# EAGLE design ABC_proto (EAGLE 6.3)
ABC - Advanced Battery Charger Intel Galileo shield with buttons, ADC divider/amplifier Cezary Rutkowski diploma work Wojskowa Akademia Techniczna
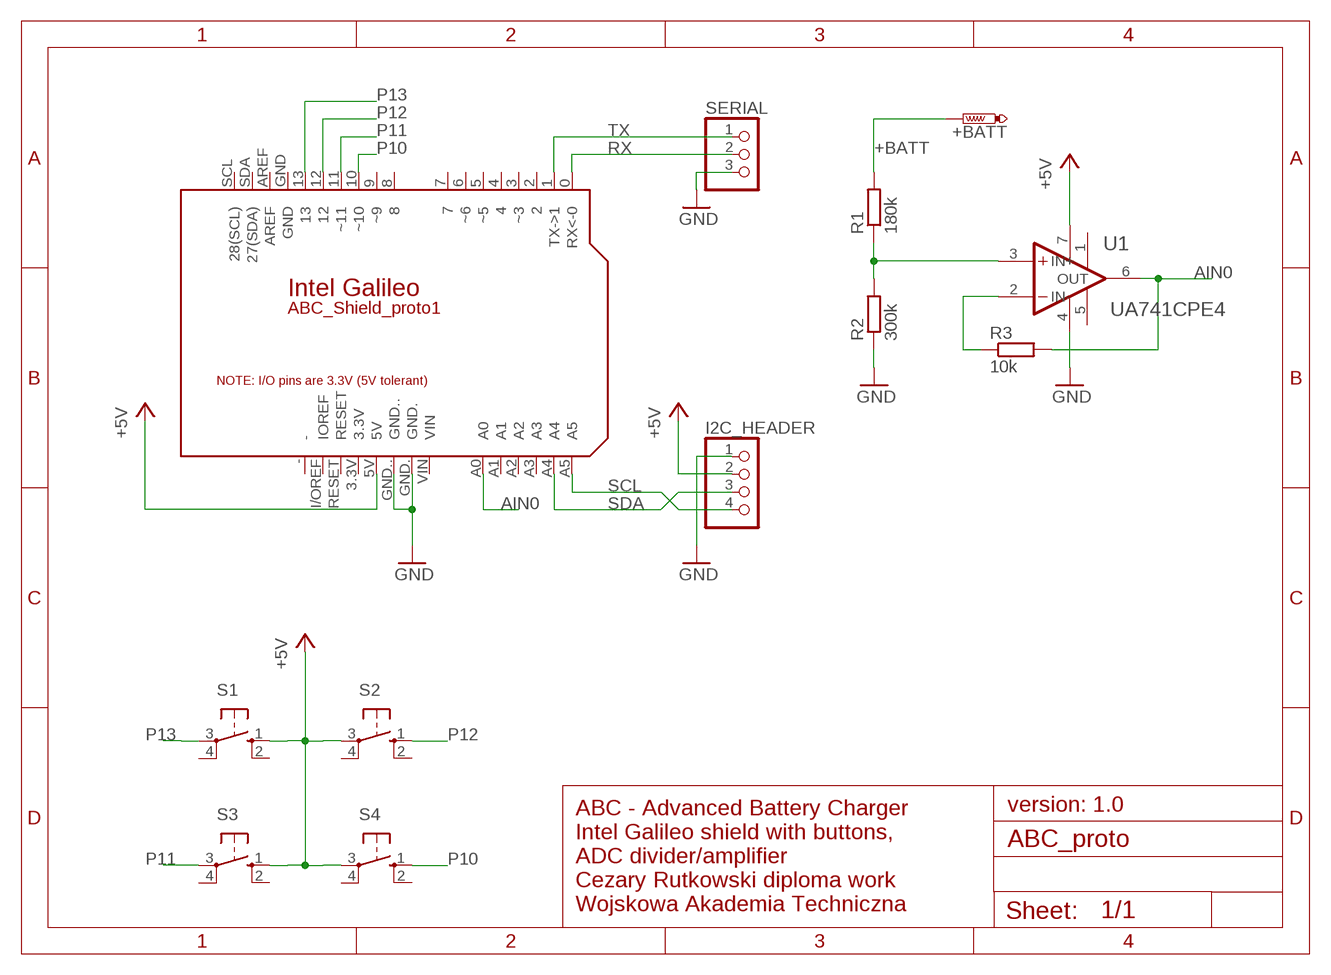
[diagram p0: schematic, sheet 1]

## Parts
+BATT  PTR1PAD1-20Y  [P1-20Y]
I2C_HEADER  PINHD-1X4  [1X04]
PCB1  ARDUINO_101  [ARDUINO_GALILEO]
R1  180k  R-EU_0204/5  [0204/5]
R2  300k  R-EU_0204/5  [0204/5]
R3  10k  R-EU_0204/5  [0204/5]
S1  10-XX  [B3F-10XX]
S2  10-XX  [B3F-10XX]
S3  10-XX  [B3F-10XX]
S4  10-XX  [B3F-10XX]
SERIAL  PINHD-1X3  [1X03]
U1  UA741CPE4  [DIP254P762X508-8]

## Nets
+5V: I2C_HEADER.2 PCB1.5V S1.1(S) S2.3(P) S3.1(S) S4.3(P) U1.7(VCC+)
+BATT: +BATT.TP R1.2
AIN0: PCB1.A0 R3.2 U1.6(OUT)
DIV: R1.1 R2.2 U1.3(IN+)
GND: I2C_HEADER.1 PCB1.GND. PCB1.GND.. R2.1 SERIAL.3 U1.4(VCC-)
N$1: R3.1 U1.2(IN-)
P10: PCB1.10(~10) S4.1(S)
P11: PCB1.11(~11) S3.3(P)
P12: PCB1.12 S2.1(S)
P13: PCB1.13 S1.3(P)
RX: PCB1.0(RX<-0) SERIAL.2
SCL: I2C_HEADER.4 PCB1.A5
SDA: I2C_HEADER.3 PCB1.A4
TX: PCB1.1(TX->1) SERIAL.1
Unconnected: PCB1.2 PCB1.3(~3) PCB1.3.3V PCB1.4 PCB1.5(~5) PCB1.6(~6) PCB1.7 PCB1.8 PCB1.9(~9) PCB1.- PCB1.A1 PCB1.A2 PCB1.A3 PCB1.AREF PCB1.GND PCB1.I/OREF(IOREF) PCB1.RESET PCB1.SCL(28(SCL)) PCB1.SDA(27(SDA)) PCB1.VIN S1.2(S1) S1.4(P1) S2.2(S1) S2.4(P1) S3.2(S1) S3.4(P1) S4.2(S1) S4.4(P1) U1.1(OFS_N1) U1.5(OFS_N2)

## Notes on the sheet
- ABC_Shield_proto1
- version: 1.0
- ABC - Advanced Battery Charger
  Intel Galileo shield with buttons, 
  ADC divider/amplifier
  Cezary Rutkowski diploma work
  Wojskowa Akademia Techniczna

## Library data of the parts
+BATT = testpad:PTR1: TEST PIN
I2C_HEADER = pinhead:PINHD-1X4: PIN HEADER
PCB1 = Arduino:ARDUINO_101: Schematic symbol for representing an Arduino/Genuino 101 board in an EAGLE schematic. Created by Dave Young for Element14. More 101 documentation at: https://www.element14.com/community/docs/DOC-80459/l/intel-genuino-101-development-board More EAGLE documentation at: http://www.element14.com/community/community/knode/cadsoft_eagle
R1-R3 = rcl:R-EU_: RESISTOR, European symbol
S1-S4 = switch-omron:10-XX: OMRON SWITCH; MPN: B3F-1000; OC_FARNELL: 176432; OC_NEWARK: 36M3542
SERIAL = pinhead:PINHD-1X3: PIN HEADER
U1 = Texas Instruments:UA741CPE4: OPERATIONAL AMPLIFIER; MPN: UA741CPE4; OC_FARNELL: 1210962; OC_NEWARK: 98K2044; PACKAGE: PDIP-8; SUPPLIER: Texas Instruments

## Board
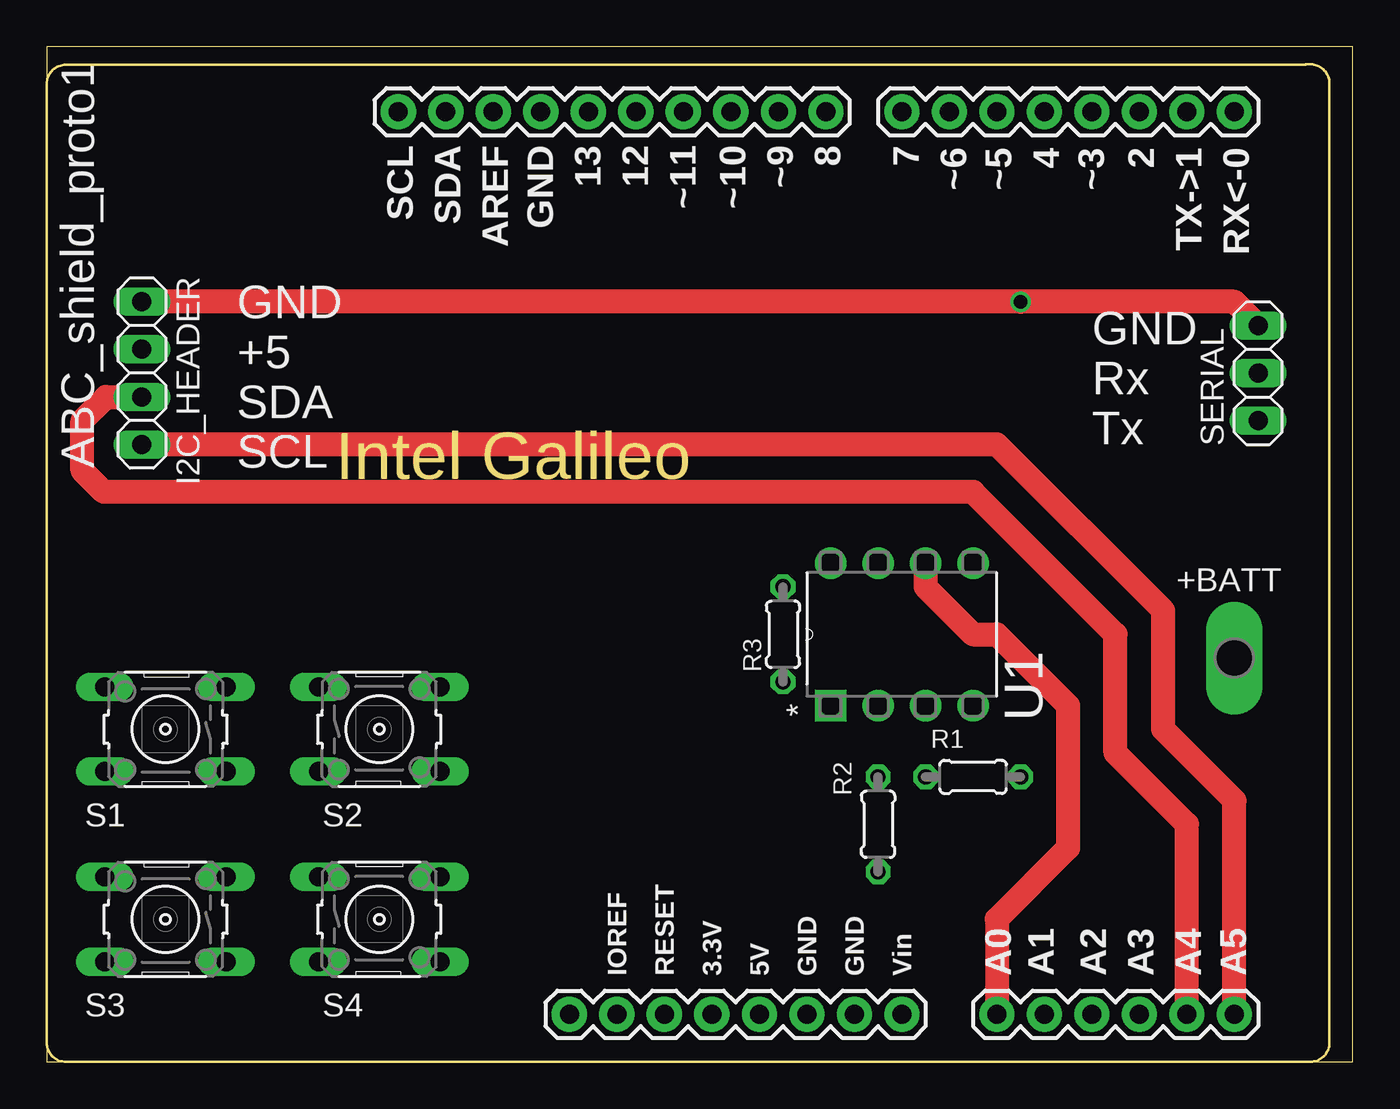
[diagram p1: board, top side]
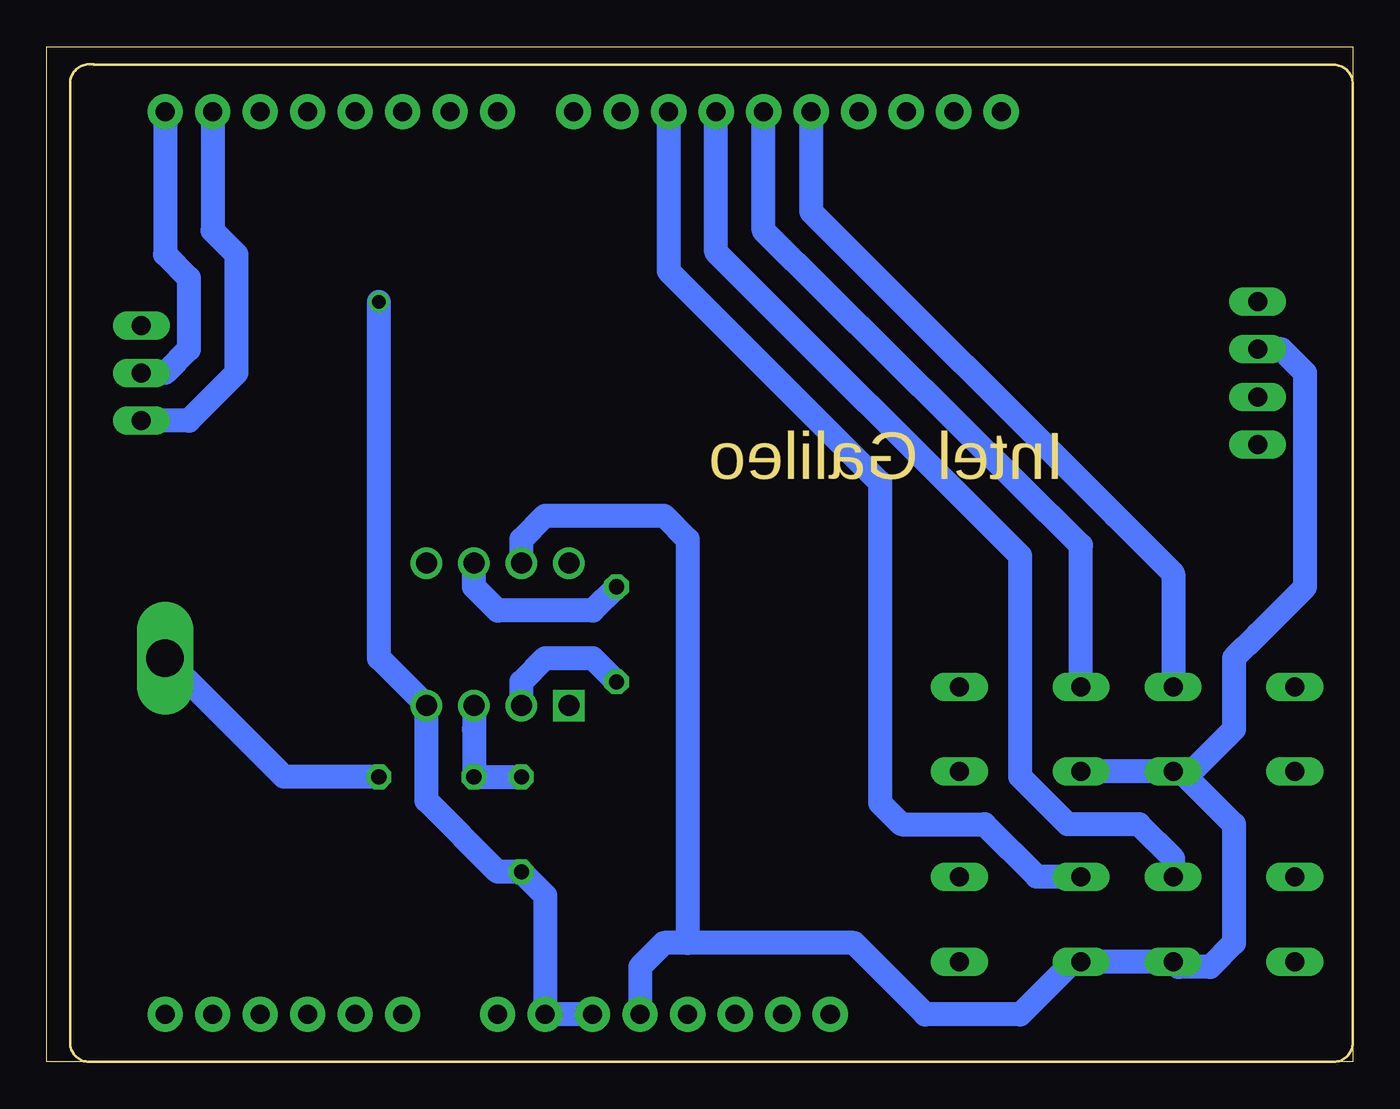
[diagram p2: board, bottom side, seen from below]

Size 69.83 x 54.28 mm. Coordinates in mm from the lower left corner, seen from the top.
Outline: 0,0 69.83,0 69.83,54.28 0,54.28 0,0
Copper layers (1*16): Top 0.035mm / dielectric 1.5mm / Bottom 0.035mm
Design rules "default": minimum track width 10mil, minimum drill 24mil, track to track 8mil, track to pad 8mil, pad to pad 8mil, via to via 8mil, smd to smd 8mil, copper to edge 40mil, drill to drill 8mil, minimum pad ring 10mil, minimum via ring 8mil, stop-mask expansion 4mil, vias tented up to drill 0mil, thermal gap 10mil

### Footprints (pad centres in the part's own frame; a part is rotated, then mirrored left to right if it is on the bottom)
P1-20Y = drill 2.007 pad 2.54 long: TP 0,0
1X04 = drill 1.016 long: 1 -3.81,0; 2 -1.27,0; 3 1.27,0; 4 3.81,0
ARDUINO_GALILEO = drill 1.016 pad 1.88: 0 27.94,25.4; 1 25.4,25.4; 2 22.86,25.4; 3 20.32,25.4; 3.3V 0,-22.86; 4 17.78,25.4; 5 15.24,25.4; 5V 2.54,-22.86; 6 12.7,25.4; 7 10.16,25.4; 8 6.096,25.4; 9 3.556,25.4; 10 1.016,25.4; 11 -1.524,25.4; 12 -4.064,25.4; 13 -6.604,25.4; - -7.62,-22.86; A0 15.24,-22.86; A1 17.78,-22.86; A2 20.32,-22.86; A3 22.86,-22.86; A4 25.4,-22.86; A5 27.94,-22.86; AREF -11.684,25.4; GND -9.144,25.4; GND. 7.62,-22.86; GND.. 5.08,-22.86; I/OREF -5.08,-22.86; RESET -2.54,-22.86; SCL -16.764,25.4; SDA -14.224,25.4; VIN 10.16,-22.86
0204/5 = drill 0.813 octagon: 1 -2.54,0; 2 2.54,0
B3F-10XX = drill 1.016 long: 1 -3.251,2.261; 2 3.251,2.261; 3 -3.251,-2.261; 4 3.251,-2.261
1X03 = drill 1.016 long: 1 -2.54,0; 2 0,0; 3 2.54,0
DIP254P762X508-8 = drill 1.118 square: 1 -7.62,7.62 | drill 1.118: 2 -7.62,5.08; 3 -7.62,2.54; 4 -7.62,0; 5 0,0; 6 0,2.54; 7 0,5.08; 8 0,7.62

### Placement (x,y rotation side)
+BATT  63.5,21.59 0 top
I2C_HEADER  5.08,36.83 270 top
PCB1  35.56,25.4 0 top
R1  49.53,15.24 0 top
R2  44.45,12.7 90 top
R3  39.37,22.86 90 top
S1  6.35,17.78 180 top
S2  17.78,17.78 0 top
S3  6.35,7.62 180 top
S4  17.78,7.62 0 top
SERIAL  64.77,36.83 90 top
U1  49.53,26.67 90 top

### Tracks (layer width: path | path; a pad name or v marks a point on that pad's centre or on a via)
+5V
  Bottom 1.27: S2.3 S1.1 9.17,15.52 8.89,15.24 | 8.89,15.24 6.35,12.7 6.35,6.35 7.62,5.08 9.32,5.08 S3.1 S4.3 14.96,5.36 17.78,2.54 22.86,2.54 26.67,6.35 35.56,6.35 | 8.89,15.24 6.35,17.78 6.35,21.59 5.08,22.86 2.54,25.4 2.54,35.56 2.54,36.83 3.81,38.1 I2C_HEADER.2 | 35.56,6.35 36.83,6.35 38.1,5.08 PCB1.5V | U1.7 44.45,27.94 43.18,29.21 36.83,29.21 35.56,27.94 35.56,6.35
+BATT
  Bottom 1.27: R1.2 57.15,15.24 +BATT.TP
AIN0
  Top 1.27: U1.6 46.99,25.4 49.53,22.86 50.8,22.86 54.61,19.05 54.61,11.43 50.8,7.62 PCB1.A0
  Bottom 1.27: R3.2 40.64,24.13 45.72,24.13 46.99,25.4 U1.6
DIV
  Bottom 1.27: U1.3 46.99,17.78 R1.1 R2.2
GND  (via drill 0.7)
  Top 1.27: 63.5,40.64 v52.07,40.64 | v52.07,40.64 I2C_HEADER.1 | 63.5,40.64 SERIAL.3 | 63.5,40.64 v52.07,40.64
  Bottom 1.27: PCB1.GND.. PCB1.GND. 43.18,8.89 R2.1 45.72,10.16 49.53,13.97 U1.4 52.07,21.59 52.07,25.4 v52.07,40.64
N$1
  Bottom 1.27: U1.2 44.45,20.32 43.18,21.59 40.64,21.59 R3.1
P10
  Bottom 1.27: PCB1.10 36.58,42.29 25.27,30.99 25.27,13.84 24.13,12.7 19.68,12.7 16.89,9.91 14.55,9.91 S4.1
P11
  Bottom 1.27: S3.3 9.6,10.87 11.43,12.7 15.24,12.7 17.78,15.24 17.78,27.05 34.04,43.31 PCB1.11
P12
  Bottom 1.27: S2.1 14.53,27.61 31.5,44.45 PCB1.12
P13
  Bottom 1.27: PCB1.13 28.96,45.47 12.7,29.21 9.6,26.11 S1.3
RX
  Bottom 1.27: PCB1.0 63.5,43.18 62.23,41.91 62.23,38.1 63.5,36.83 SERIAL.2
SCL
  Top 1.27: PCB1.A5 63.5,13.97 59.69,17.78 59.69,24.13 50.8,33.02 I2C_HEADER.4
SDA
  Top 1.27: PCB1.A4 60.96,12.7 57.15,16.51 57.15,22.86 49.53,30.48 7.37,30.48 3.05,30.48 1.91,31.62 1.91,34.29 3.17,35.56 I2C_HEADER.3
TX
  Bottom 1.27: PCB1.1 60.96,44.45 59.69,43.18 59.69,36.83 62.23,34.29 SERIAL.1

### Text on the board
tNames: GND / Rx / Tx | ABC_shield_proto1 | GND / +5 / SDA / SCL